# Altium schematic sheet 电流脉冲检测.SchDoc
size A4
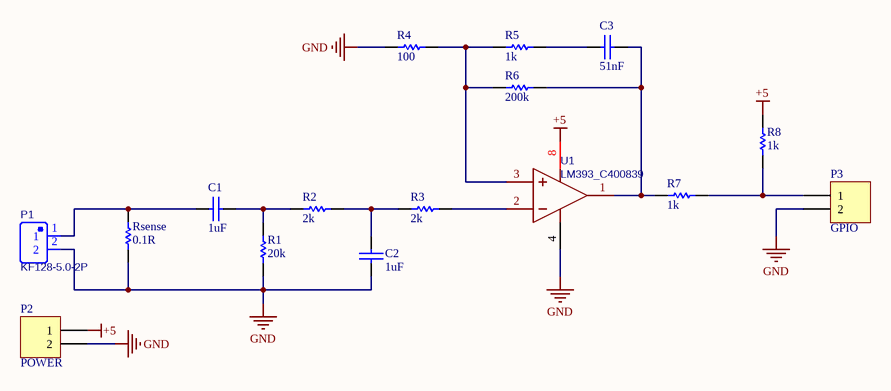
[diagram p0: 电流脉冲检测.SchDoc]

## Parts
C1  1uF  [0805C]
C2  1uF  [0805C]
C3  51nF  [1206C]
P1  KF128-5.0-2P  [CONN-TH_P5.00_KF128-5.0-2P]
P2  POWER  [HDR1X2]
P3  GPIO  [HDR1X2]
R1  20k  [0805R]
R2  2k  [0805R]
R3  2k  [0805R]
R4  100  [0805R]
R5  1k  [0805R]
R6  200k  [0805R]
R7  1k  [0805R]
R8  1k  [0805R]
Rsense  0.1R  [R2512]
U1  LM393_C400839  [SOP-8_L4.9-W3.9-P1.27-LS6.0-BL]

## Nets
+5: P2.1 R8.2 U1.8(VCC)
GND: C2.1 P1.2 P2.2 P3.2 R1.1 R4.1 Rsense.2 U1.4(GND)
NetC1_1: C1.1 P1.1 Rsense.1
NetC1_2: C1.2 R1.2 R2.1
NetC2_2: C2.2 R2.2 R3.1
NetC3_1: C3.1 R5.2
NetC3_2: C3.2 R6.2 R7.1 U1.1(OUTA)
NetP3_1: P3.1 R7.2 R8.1
NetR3_2: R3.2 U1.2(INA-)
NetR4_2: R4.2 R5.1 R6.1 U1.3(INA+)

## Library data of the parts
C1 C2 = CAP: Capacitor
C3 = cap_1206
P1 = KF128-2P: BOM_Manufacturer: Cixi Kefa Elec; Contributor: LCSC; BOM_Supplier: LCSC; BOM_Supplier Part: C474950; BOM_Manufacturer Part: KF128-5.0-2P; spicePre: U; spiceSymbolName: KF128-5.0-2P
P2 P3 = Header 2: Header, 2-Pin; LatestRevisionDate: 17-Jul-2002; LatestRevisionNote: Re-released for DXP Platform.; Publisher: Altium Limited
R1-R8 = Res1: Resistor
Rsense = Rsense
U1 = LM393_A: BOM_Manufacturer: IDCHIP; BOM_Manufacturer Part: LM393; subpart_no: 2; BOM_Supplier: LCSC; BOM_Supplier Part: C400839; spicePre: U; spiceSymbolName: LM393_C400839